# EAGLE design 11_21_22 Inverter (EAGLE 9.6.2)
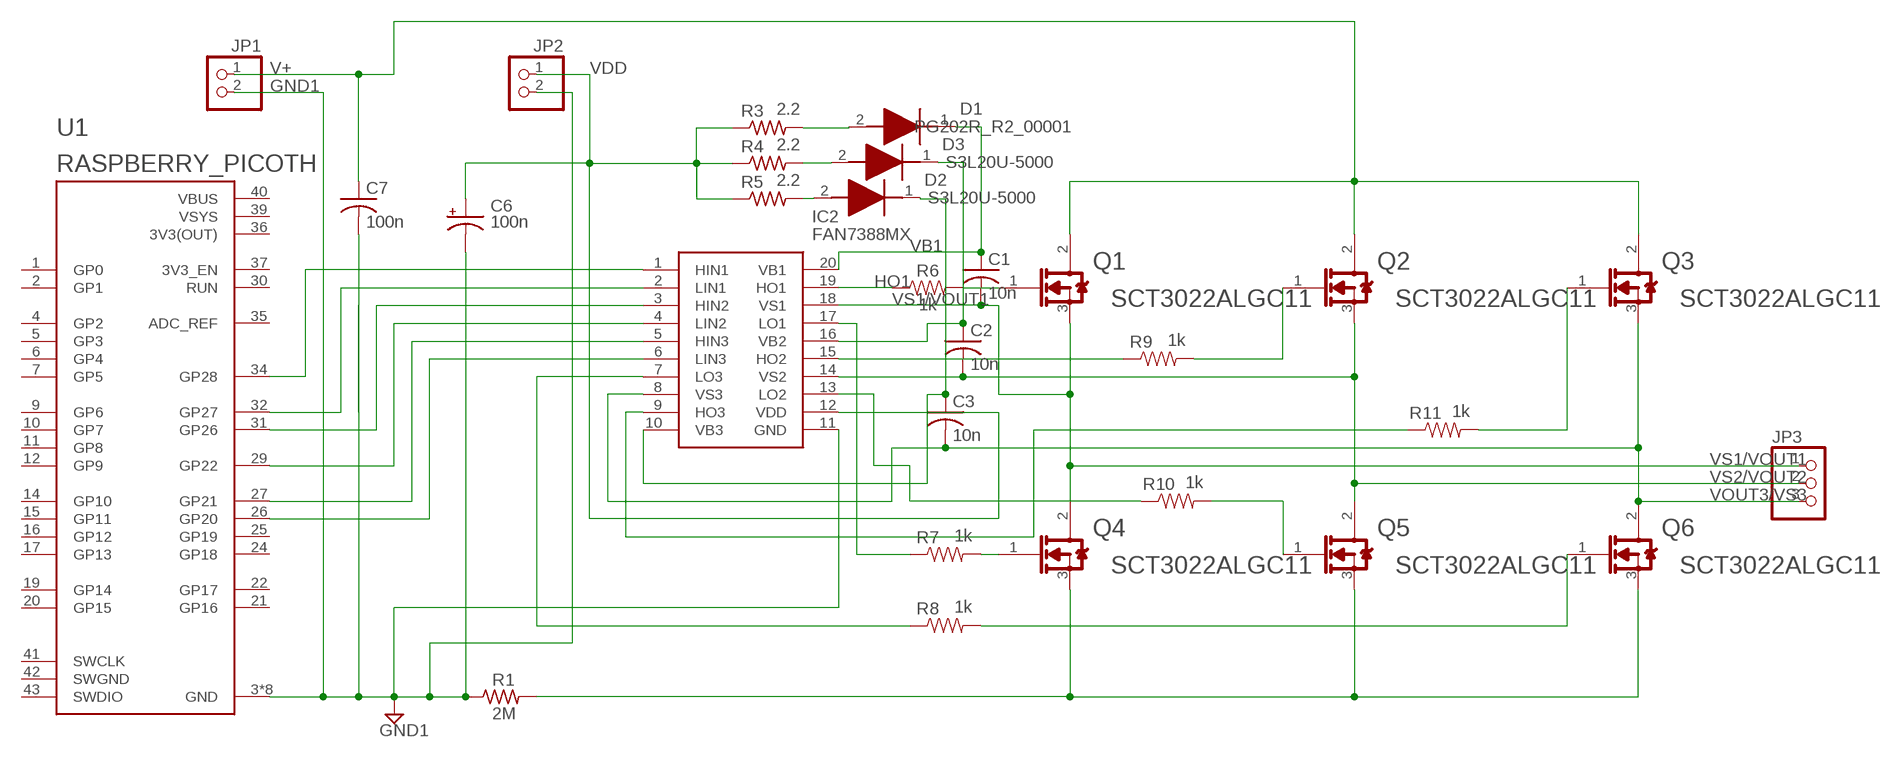
[diagram p0: schematic, sheet 1]

## Parts
C1  10n  C-US025-024X044  [C025-024X044]
C2  10n  C-US025-024X044  [C025-024X044]
C3  10n  C-US025-024X044  [C025-024X044]
C6  100n  CPOL-USSMCZ  [SMC_Z]
C7  100n  C-US025-024X044  [C025-024X044]
D1  PG202R_R2_00001  S3L20U-5000  [DIOAD2460W140L700D440]
D2  S3L20U-5000  [DIOAD2460W140L700D440]
D3  S3L20U-5000  [DIOAD2460W140L700D440]
IC2  FAN7388MX  [SOIC127P1032X265-20N]
JP1  PINHD-1X2  [1X02]
JP2  PINHD-1X2  [1X02]
JP3  PINHD-1X3  [1X03]
Q1  ROHM_SCT3022ALGC11ROHM_SCT3022ALGC11_0_0  [ROHM_SCT3022ALGC11_0]
Q2  ROHM_SCT3022ALGC11ROHM_SCT3022ALGC11_0_0  [ROHM_SCT3022ALGC11_0]
Q3  ROHM_SCT3022ALGC11ROHM_SCT3022ALGC11_0_0  [ROHM_SCT3022ALGC11_0]
Q4  ROHM_SCT3022ALGC11ROHM_SCT3022ALGC11_0_0  [ROHM_SCT3022ALGC11_0]
Q5  ROHM_SCT3022ALGC11ROHM_SCT3022ALGC11_0_0  [ROHM_SCT3022ALGC11_0]
Q6  ROHM_SCT3022ALGC11ROHM_SCT3022ALGC11_0_0  [ROHM_SCT3022ALGC11_0]
R1  2M  R-US_0207/10  [0207/10]
R3  2.2  R-US_0207/10  [0207/10]
R4  2.2  R-US_0207/10  [0207/10]
R5  2.2  R-US_0207/10  [0207/10]
R6  1k  RESISTOR0603  [0603]
R7  1k  RESISTOR0603  [0603]
R8  1k  RESISTOR0603  [0603]
R9  1k  RESISTOR0603  [0603]
R10  1k  RESISTOR0603  [0603]
R11  1k  RESISTOR0603  [0603]
U1  RASPBERRY_PICOTH  [PICO-PKG-TH]

## Nets
COM/GND: Q4.3(SOURCE) Q5.3(SOURCE) Q6.3(SOURCE) R1.2
GND1: C6.- C7.2 IC2.11(GND) JP1.2 JP2.2 R1.1 U1.3(GND) U1.8(GND) U1.13(GND) U1.18(GND) U1.23(GND) U1.28(GND) U1.33(GND) U1.38(GND)
HO1: IC2.19(HO1) R6.1
HO2: IC2.15(HO2) R9.1
LO2: IC2.13(LO2) R10.1
LO3: IC2.7(LO3) R8.1
N$1: IC2.1(HIN1) U1.34(GP28)
N$2: IC2.17(LO1) R7.1
N$3: IC2.2(LIN1) U1.32(GP27)
N$4: IC2.3(HIN2) U1.31(GP26)
N$5: IC2.4(LIN2) U1.29(GP22)
N$6: Q1.1(GATE) R6.2
N$7: IC2.5(HIN3) U1.27(GP21)
N$8: Q5.1(GATE) R10.2
N$9: IC2.6(LIN3) U1.26(GP20)
N$10: Q3.1(GATE) R11.2
N$11: Q2.1(GATE) R9.2
N$12: IC2.9(HO3) R11.1
N$14: Q6.1(GATE) R8.2
N$16: Q4.1(GATE) R7.2
N$26: D1.2(A) R3.2
N$28: D3.2(A) R4.2
N$29: D2.2(A) R5.2
V+: C7.1 JP1.1 Q1.2(DRAIN) Q2.2(DRAIN) Q3.2(DRAIN)
VB1: C1.1 D1.1(K) IC2.20(VB1)
VB2: C2.1 D3.1(K) IC2.16(VB2)
VB3: C3.1 D2.1(K) IC2.10(VB3)
VDD: C6.+ IC2.12(VDD) JP2.1 R3.1 R4.1 R5.1
VOUT3/VS3: C3.2 IC2.8(VS3) JP3.3 Q3.3(SOURCE) Q6.2(DRAIN)
VS1/VOUT1: C1.2 IC2.18(VS1) JP3.1 Q1.3(SOURCE) Q4.2(DRAIN)
VS2/VOUT2: C2.2 IC2.14(VS2) JP3.2 Q2.3(SOURCE) Q5.2(DRAIN)
Unconnected: U1.1(GP0) U1.2(GP1) U1.4(GP2) U1.5(GP3) U1.6(GP4) U1.7(GP5) U1.9(GP6) U1.10(GP7) U1.11(GP8) U1.12(GP9) U1.14(GP10) U1.15(GP11) U1.16(GP12) U1.17(GP13) U1.19(GP14) U1.20(GP15) U1.21(GP16) U1.22(GP17) U1.24(GP18) U1.25(GP19) U1.30(RUN) U1.35(ADC_REF) U1.37(3V3_EN) U1.41(SWCLK) U1.43(SWDIO)

## Power pins joined to a net without a drawn wire
3V3(OUT): U1.36(3V3(OUT))
SWGND: U1.42(SWGND)
VBUS: U1.40(VBUS)
VSYS: U1.39(VSYS)

## Library data of the parts
C1-C3 C7 = rcl:C-US: CAPACITOR, American symbol; SPICEPREFIX: C
C6 = rcl:CPOL-US: POLARIZED CAPACITOR, American symbol; SPICEPREFIX: C
D1 = S3L20U-5000:S3L20U-5000: Diodes - General Purpose, Power, Switching Fast Recovery Diode Source: Datasheet <https://componentsearchengine.com/Datasheets/1/S3L20U-5000.pdf>; DESCRIPTION: Diodes - General Purpose, Power, Switching Fast Recovery Diode; HEIGHT: mm; MANUFACTURER_NAME: Shindengen; MANUFACTURER_PART_NUMBER: PG202R_R2_00001; MOUSER_PART_NUMBER: PG202R_R2_00001; MOUSER_PRICE-STOCK: https://www.mouser.com/Search/Refine.aspx?Keyword=627-S3L20U-5000
D2 D3 = S3L20U-5000:S3L20U-5000: Diodes - General Purpose, Power, Switching Fast Recovery Diode Source: Datasheet <https://componentsearchengine.com/Datasheets/1/S3L20U-5000.pdf>; DESCRIPTION: Diodes - General Purpose, Power, Switching Fast Recovery Diode; HEIGHT: mm; MANUFACTURER_NAME: Shindengen; MANUFACTURER_PART_NUMBER: S3L20U-5000; MOUSER_PART_NUMBER: 627-S3L20U-5000; MOUSER_PRICE-STOCK: https://www.mouser.com/Search/Refine.aspx?Keyword=627-S3L20U-5000
IC2 = FAN7388MX:FAN7388MX: IC, Fairchild, FAN7388MX Fairchild Semiconductor FAN7388MX, Triple MOSFET Power Driver 350 mA, 650 mA Half Bridge, 10 20 V, Inverting Source: Datasheet <https://componentsearchengine.com/Datasheets/1/FAN7388MX.pdf>; DESCRIPTION: IC, Fairchild, FAN7388MX Fairchild Semiconductor FAN7388MX, Triple MOSFET Power Driver 350 mA, 650 mA Half Bridge, 10 20 V, Inverting; HEIGHT: 2.65mm; MANUFACTURER_NAME: onsemi; MANUFACTURER_PART_NUMBER: FAN7388MX; MOUSER_PART_NUMBER: 512-FAN7388MX; MOUSER_PRICE-STOCK: https://www.mouser.com/Search/Refine.aspx?Keyword=512-FAN7388MX
JP1 JP2 = pinhead:PINHD-1X2: PIN HEADER
JP3 = pinhead:PINHD-1X3: PIN HEADER
Q1-Q6 = ROHM - SCT3022ALGC11:ROHM_SCT3022ALGC11: MOSFET NCH 650V 93A TO247N; CENTROID_NOT_SPECIFIED: No; CONTINUOUS_DRAIN_CURRENT: 93A; DATASHEET: https://www.rohm.com/datasheet/SCT3022AL/sct3022al-e; DEVICE_CLASS_L1: Discrete Semiconductors; DEVICE_CLASS_L2: Transistors; DEVICE_CLASS_L3: MOSFETs; DIGIKEY_DESCRIPTION: TRANS MOSFET NCH 650V 93A TO247N; DIGIKEY_PART_NUMBER: SCT3022ALGC11-ND; DRAIN_TO_SOURCE_BREAKDOWN_VOLTAGE: 650V; DRAIN_TO_SOURCE_RESISTANCE: 22mΩ; DRAIN_TO_SOURCE_VOLTAGE: 650V; FOOTPRINT_URL: https://d1d2qsbl8m0m72.cloudfront.net/en/techdata_basic/power/dimension/SiC_TO-247N-e.pdf; GATE_TO_SOURCE_VOLTAGE: 22V; HEIGHT: 25.5mm; INPUT_CAPACITACE_AT_VDS: 2208pF @ 500V; LEAD_FREE: yes; MAX_JUNCTION_TEMP: +175°C; MF: ROHM; MFG_PACKAGE_IDENT: SCT3022ALGC11; MFG_PACKAGE_IDENT_DATE: 2/2017; MFG_PACKAGE_IDENT_REV: 001; MOUSER_DESCRIPTION: SCT3022AL Series 650 V 93 A 28.6 mOhm N-Channel SiC Power Mosfet - TO-247N; MOUSER_PART_NUMBER: 755-SCT3022ALGC11; MPN: SCT3022ALGC11; NUMBER_OF_CHANNELS: 1; NUMBER_OF_N_CHANNELS: 1; PACKAGE: TO247; POWER_DISSIPATION: 339W; PREFIX: Q; ROHS: yes; STANDOFF_HEIGHT: 3.8mm; TECHNOLOGY: MOSFET; TEMPERATURE_RANGE_HIGH: +175°C; THRESHOLD_VGS: 2.7V; TURN_OFF_DELAY_TIME: 61ns; TURN_ON_DELAY_TIME: 25ns; VERIFICATION_VERSION: 0.0.0.1
R1 R3-R5 = rcl:R-US_: RESISTOR, American symbol; SPICEPREFIX: R
R6-R11 = SparkFun-Resistors:RESISTOR: Generic Resistor Package
U1 = RpiPico:RASPBERRY_PICO: Raspberry Pi Pico

## Board
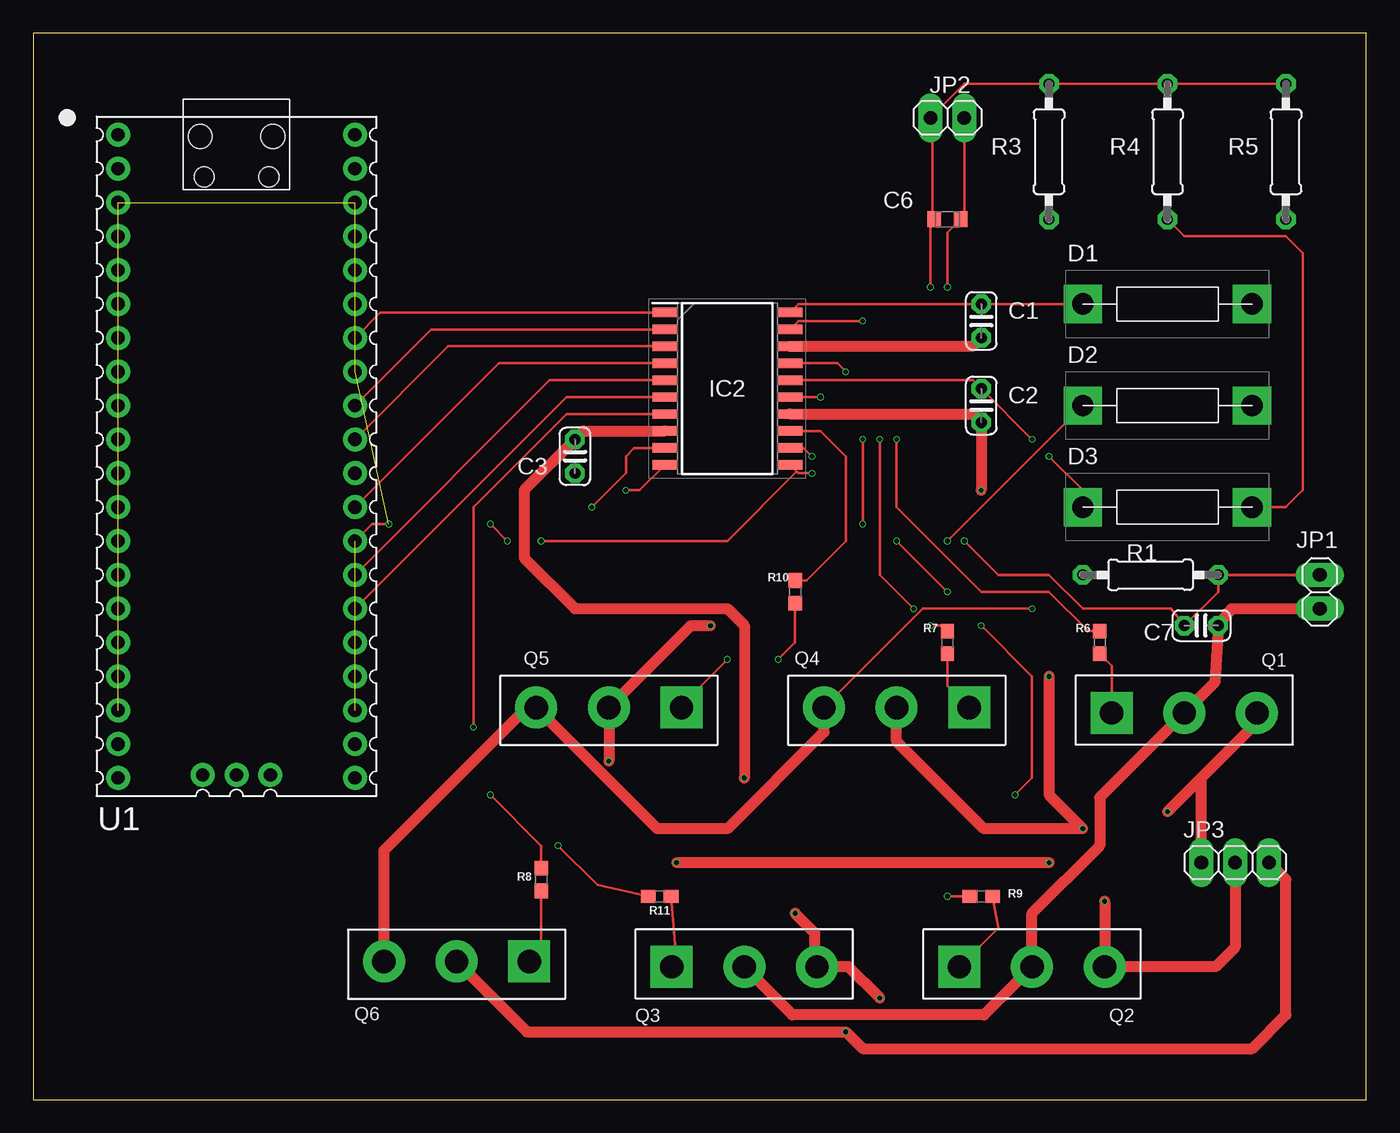
[diagram p1: board, top side]
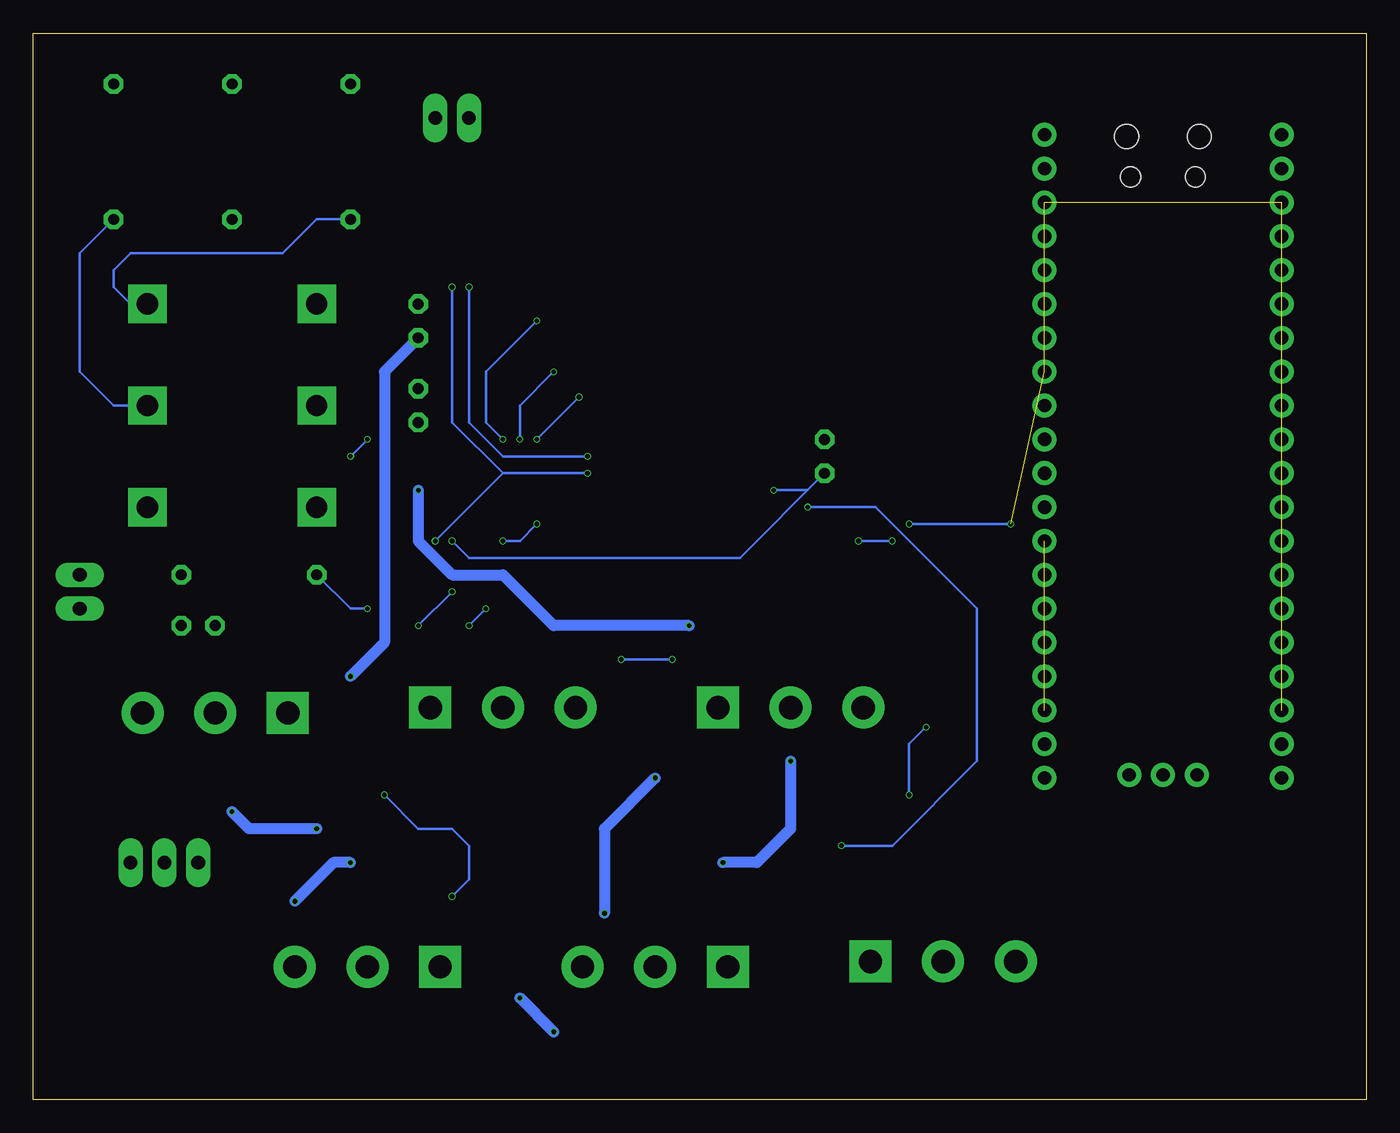
[diagram p2: board, bottom side, seen from below]

Size 100 x 80 mm. Coordinates in mm from the lower left corner, seen from the top.
Outline: 0,0 100,0 100,80 0,80 0,0
Copper layers (1*16): Top 0.035mm / dielectric 1.6mm / Bottom 0.035mm
Design rules "jlcpcb-2layers": minimum track width 5mil, minimum drill 0.3mm, track to track 5mil, track to pad 5mil, pad to pad 5mil, via to via 5mil, smd to smd 5mil, copper to edge 0.2mm, drill to drill 6mil, minimum pad ring 10mil, minimum via ring 3mil, stop-mask expansion 4mil, vias tented up to drill 0mil, thermal gap 10mil

### Footprints (pad centres in the part's own frame; a part is rotated, then mirrored left to right if it is on the bottom)
C025-024X044 = drill 0.813 octagon: 1 -1.27,0; 2 1.27,0
SMC_Z = smd 1 x 1.2: + -1,0; - 1,0
DIOAD2460W140L700D440 = drill 1.6 pad 2.4 square: 1 1.27,0; 2 13.97,0
SOIC127P1032X265-20N = smd 1.875 x 0.7: 1 -4.688,5.715; 2 -4.688,4.445; 3 -4.688,3.175; 4 -4.688,1.905; 5 -4.688,0.635; 6 -4.688,-0.635; 7 -4.688,-1.905; 8 -4.688,-3.175; 9 -4.688,-4.445; 10 -4.688,-5.715; 11 4.688,-5.715; 12 4.688,-4.445; 13 4.688,-3.175; 14 4.688,-1.905; 15 4.688,-0.635; 16 4.688,0.635; 17 4.688,1.905; 18 4.688,3.175; 19 4.688,4.445; 20 4.688,5.715
1X02 = drill 1.016 long: 1 -1.27,0; 2 1.27,0
1X03 = drill 1.016 long: 1 -2.54,0; 2 0,0; 3 2.54,0
ROHM_SCT3022ALGC11_0 = drill 1.75 pad 2.65 square: 1 -0.2,5.45 | drill 1.75 pad 2.65: 2 -0.2,0; 3 -0.2,-5.45
0207/10 = drill 0.813 octagon: 1 -5.08,0; 2 5.08,0
0603 = smd 1.1 x 1: 1 -0.85,0; 2 0.85,0
PICO-PKG-TH = drill 1: 1 -8.89,24.13; 2 -8.89,21.59; 3 -8.89,19.05; 4 -8.89,16.51; 5 -8.89,13.97; 6 -8.89,11.43; 7 -8.89,8.89; 8 -8.89,6.35; 9 -8.89,3.81; 10 -8.89,1.27; 11 -8.89,-1.27; 12 -8.89,-3.81; 13 -8.89,-6.35; 14 -8.89,-8.89; 15 -8.89,-11.43; 16 -8.89,-13.97; 17 -8.89,-16.51; 18 -8.89,-19.05; 19 -8.89,-21.59; 20 -8.89,-24.13; 21 8.89,-24.13; 22 8.89,-21.59; 23 8.89,-19.05; 24 8.89,-16.51; 25 8.89,-13.97; 26 8.89,-11.43; 27 8.89,-8.89; 28 8.89,-6.35; 29 8.89,-3.81; 30 8.89,-1.27; 31 8.89,1.27; 32 8.89,3.81; 33 8.89,6.35; 34 8.89,8.89; 35 8.89,11.43; 36 8.89,13.97; 37 8.89,16.51; 38 8.89,19.05; 39 8.89,21.59; 40 8.89,24.13; 41 -2.54,-23.9; 42 0,-23.9; 43 2.54,-23.9 | hole 1.8: -2.725,24; 2.725,24 | hole 1.5: -2.425,20.97; 2.425,20.97

### Placement (x,y rotation side)
C1  71.12,58.42 270 top
C2  71.12,52.07 270 top
C3  40.64,48.26 90 top
C6  68.58,66.04 0 top
C7  87.63,35.56 180 top
D1  77.47,59.69 0 top
D2  77.47,52.07 0 top
D3  77.47,44.45 0 top
IC2  52.07,53.34 0 top
JP1  96.52,38.1 90 top
JP2  68.58,73.66 0 top
JP3  90.17,17.78 0 top
Q1  86.36,29.21 90 top
Q2  74.93,10.16 90 top
Q3  53.34,10.16 90 top
Q4  64.77,29.21 270 top
Q5  43.18,29.21 270 top
Q6  31.75,10.16 270 top
R1  83.82,39.37 180 top
R3  76.2,71.12 270 top
R4  85.09,71.12 270 top
R5  93.98,71.12 270 top
R6  80.01,34.29 270 top
R7  68.58,34.29 270 top
R8  38.1,16.51 270 top
R9  71.12,15.24 0 top
R10  57.15,38.1 270 top
R11  46.99,15.24 0 top
U1  15.24,48.26 0 top

### Tracks (layer width: path | path; a pad name or v marks a point on that pad's centre or on a via)
COM/GND  (via drill 0.35)
  Top 0.203: Q4.3 66.74,36.83 v74.93,36.83
  Top 0.813: Q6.3 26.3,18.68 37.03,29.41 Q5.3 46.82,20.32 52.07,20.32 59.32,27.57 Q4.3
  Bottom 0.203: R1.2 76.2,36.83 v74.93,36.83
GND1  (via drill 0.35)  (7 unrouted)
  Top 0.203: IC2.11 57.27,47.11 | 57.27,47.11 57.39,46.99 v58.42,46.99 | v69.85,41.91 72.39,39.37 76.2,39.37 78.74,36.83 85.36,36.83 C7.2 88.9,38.1 R1.1 JP1.2 | v68.58,60.96 68.58,65.04 C6.- 69.85,66.31 JP2.2 | 57.27,47.11 52.07,41.91 v38.1,41.91 | v35.56,41.91 v34.29,43.18 | v26.67,43.18 25.4,43.18 U1.28
  Bottom 0.203: v58.42,46.99 64.77,46.99 | 64.77,46.99 68.58,50.8 v68.58,60.96 | 64.77,46.99 v69.85,41.91 | v38.1,41.91 v35.56,41.91 | v34.29,43.18 v26.67,43.18
HO1  (via drill 0.35)
  Top 0.203: IC2.19 57.39,58.42 v62.23,58.42 | R6.1 79.16,35.14 76.2,38.1 71.12,38.1 64.77,44.45 v64.77,49.53
  Bottom 0.203: v62.23,58.42 66.04,54.61 66.04,50.8 v64.77,49.53
HO2  (via drill 0.35)
  Top 0.203: IC2.15 v59.05,52.7 | v73.66,22.86 74.93,24.13 74.93,31.75 v71.12,35.56 | v68.58,38.1 v64.77,41.91 | v62.23,43.18 v62.23,49.53 | v68.58,15.24 R9.1
  Bottom 0.203: v71.12,35.56 v68.58,38.1 | v64.77,41.91 63.5,41.91 v62.23,43.18 | v73.66,22.86 71.12,20.32 68.58,20.32 67.31,19.05 67.31,16.51 v68.58,15.24 | v59.05,52.7 v62.23,49.53
LO2
  Top 0.203: IC2.13 59.05,50.16 60.96,48.26 60.96,41.91 58,38.95 R10.1
LO3  (via drill 0.35)
  Top 0.203: IC2.7 40.01,51.44 33.02,44.45 v33.02,27.94 | v34.29,22.86 38.1,19.05 R8.1
  Bottom 0.203: v33.02,27.94 34.29,26.67 v34.29,22.86
N$1
  Top 0.203: IC2.1 26.04,59.05 U1.34
N$2  (via drill 0.35)
  Top 0.203: IC2.17 60.33,55.24 v60.96,54.61 | v66.04,36.83 63.5,39.37 v63.5,49.53 | v67.31,35.56 68.16,35.56 R7.1
  Bottom 0.203: v60.96,54.61 63.5,52.07 v63.5,49.53 | v66.04,36.83 v67.31,35.56
N$3
  Top 0.203: IC2.2 29.84,57.78 U1.32
N$4
  Top 0.203: IC2.3 31.11,56.52 U1.31
N$5
  Top 0.203: IC2.4 34.93,55.24 U1.29
N$6
  Top 0.203: R6.2 80.91,32.54 Q1.1
N$7
  Top 0.203: IC2.5 38.74,53.98 U1.27
N$8  (via drill 0.35)
  Top 0.203: v52.07,33.02 48.63,29.58 Q5.1 | v55.88,33.02 57.15,34.29 R10.2
  Bottom 0.203: v52.07,33.02 v55.88,33.02
N$9
  Top 0.203: IC2.6 40.01,52.7 U1.26
N$10
  Top 0.203: R11.2 48.26,10.33 Q3.1
N$11
  Top 0.203: R9.2 72.39,12.87 Q2.1
N$12  (via drill 0.35)
  Top 0.203: R11.1 42.33,16.09 v39.37,19.05 | IC2.9 45.09,48.9 44.45,48.26 44.45,46.99 v41.91,44.45
  Bottom 0.203: v39.37,19.05 35.56,19.05 29.21,25.4 29.21,36.83 36.83,44.45 v41.91,44.45
N$14
  Top 0.203: R8.2 38.1,11.26 Q6.1
N$16
  Top 0.203: R7.2 68.58,31.05 Q4.1
N$26
  Bottom 0.203: R3.2 78.74,66.04 81.28,63.5 92.71,63.5 93.98,62.23 93.98,60.96 92.71,59.69 D1.2
N$28
  Top 0.203: R4.2 86.36,64.77 93.98,64.77 95.25,63.5 95.25,45.72 93.98,44.45 D3.2
N$29
  Bottom 0.203: D2.2 93.98,52.07 96.52,54.61 96.52,63.5 R5.2
V+
  Top 0.813: Q3.2 56.95,6.35 71.32,6.35 Q2.2 74.93,13.97 80.01,19.05 80.01,22.66 Q1.2 88.63,31.28 C7.1 89.9,36.83 JP1.1
VB1
  Top 0.203: IC2.20 57.39,59.69 C1.1 D1.1
VB2  (via drill 0.35)
  Top 0.203: IC2.16 70.48,53.98 C2.1 v74.93,49.53 | v76.2,48.26 78.74,45.72 D3.1
  Bottom 0.203: v74.93,49.53 v76.2,48.26
VB3  (via drill 0.35)
  Top 0.203: IC2.10 45.48,45.72 v44.45,45.72 | v68.58,41.91 D2.1
  Bottom 0.203: v44.45,45.72 41.91,45.72 C3.1 46.99,40.64 67.31,40.64 v68.58,41.91
VDD  (via drill 0.35)
  Top 0.203: IC2.12 57.79,48.9 v58.42,48.26 | v67.31,60.96 67.31,65.77 67.44,65.91 | 67.44,65.91 C6.+ | 67.44,65.91 67.44,73.53 JP2.1 69.85,76.2 R3.1 R4.1 R5.1
  Bottom 0.203: v58.42,48.26 64.77,48.26 67.31,50.8 v67.31,60.96
VOUT3/VS3  (via drill 0.35)
  Top 0.813: Q6.2 37.03,5.08 v60.96,5.08 62.23,3.81 91.44,3.81 93.98,6.35 93.98,16.51 JP3.3 | v63.5,7.62 61.16,9.96 Q3.3 58.62,9.96 58.62,12.5 v57.15,13.97 | IC2.8 41.28,50.16 C3.2 36.83,45.72 36.83,40.64 40.64,36.83 52.07,36.83 53.34,35.56 v53.34,24.13
  Bottom 0.813: v60.96,5.08 v63.5,7.62 | v57.15,13.97 57.15,20.32 v53.34,24.13
VS1/VOUT1  (via drill 0.35)
  Top 0.813: Q4.2 64.77,26.87 71.32,20.32 v78.74,20.32 76.2,22.86 v76.2,31.75 | v85.09,21.59 87.63,24.13 | JP3.1 87.63,24.13 | Q1.3 91.81,28.31 87.63,24.13 | IC2.18 70.48,56.52 C1.2
  Bottom 0.813: v76.2,31.75 73.66,34.29 73.66,54.61 C1.2 | v85.09,21.59 83.82,20.32 v78.74,20.32
VS2/VOUT2  (via drill 0.35)
  Top 0.813: v80.38,14.87 Q2.3 88.7,9.96 90.17,11.43 JP3.2 | v43.18,25.4 Q5.2 49.33,35.56 v50.8,35.56 | v48.26,17.78 v76.2,17.78 | IC2.14 70.48,51.44 C2.2 v71.12,45.72
  Bottom 0.813: v76.2,17.78 77.47,17.78 v80.38,14.87 | v43.18,25.4 43.18,20.32 45.72,17.78 v48.26,17.78 | v50.8,35.56 60.96,35.56 64.77,39.37 68.58,39.37 71.12,41.91 v71.12,45.72